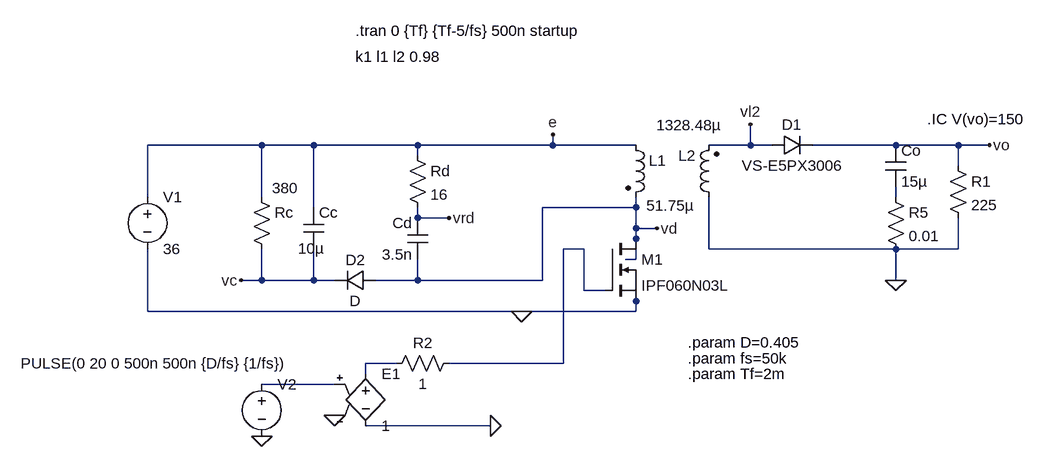
[diagram p0: schematic flyback_ma.asc]
flyback_ma.asc, the LTspice schematic file:
Version 4
SHEET 1 1080 680
WIRE -112 64 -288 64
WIRE -32 64 -112 64
WIRE 128 64 -32 64
WIRE 336 64 336 48
WIRE 336 64 128 64
WIRE 464 64 336 64
WIRE 640 64 640 32
WIRE 640 64 576 64
WIRE 672 64 640 64
WIRE 864 64 736 64
WIRE 960 64 864 64
WIRE 1008 64 960 64
WIRE 128 80 128 64
WIRE 960 96 960 64
WIRE -288 144 -288 64
WIRE -112 144 -112 64
WIRE 864 144 864 128
WIRE -32 160 -32 64
WIRE 464 160 464 144
WIRE 464 160 320 160
WIRE 128 176 128 160
WIRE 176 176 128 176
WIRE 464 192 464 160
WIRE 496 192 464 192
WIRE 464 208 464 192
WIRE 384 224 352 224
WIRE 576 224 576 144
WIRE 864 224 576 224
WIRE 960 224 960 176
WIRE 960 224 864 224
WIRE 464 240 464 208
WIRE 464 240 448 240
WIRE -112 272 -112 224
WIRE -112 272 -144 272
WIRE -32 272 -32 224
WIRE -32 272 -112 272
WIRE 0 272 -32 272
WIRE 128 272 128 240
WIRE 128 272 64 272
WIRE 320 272 320 160
WIRE 320 272 128 272
WIRE 864 272 864 224
WIRE 384 288 384 224
WIRE 416 288 384 288
WIRE 464 304 464 288
WIRE -288 320 -288 224
WIRE 288 320 -288 320
WIRE 464 320 464 304
WIRE 464 320 288 320
WIRE 96 400 48 400
WIRE 352 400 352 224
WIRE 352 400 176 400
WIRE 48 416 48 400
WIRE 0 432 -112 432
WIRE 240 496 48 496
FLAG 864 272 0
FLAG 288 320 0
FLAG 0 480 0
FLAG -112 512 0
FLAG 240 496 0
FLAG 1008 64 vo
FLAG 496 192 vd
FLAG 336 48 e
FLAG -144 272 vc
FLAG 176 176 vrd
FLAG 640 32 vl2
SYMBOL voltage -288 128 R0
WINDOW 123 0 0 Left 2
WINDOW 39 0 0 Left 2
SYMATTR InstName V1
SYMATTR Value 36
SYMBOL ind2 448 48 R0
WINDOW 3 32 109 Left 2
SYMATTR Value 51.75µ
SYMATTR InstName L1
SYMATTR Type ind
SYMBOL ind2 592 160 R180
WINDOW 0 36 80 Left 2
WINDOW 3 -5 127 Left 2
SYMATTR InstName L2
SYMATTR Value 1328.48µ
SYMATTR Type ind
SYMBOL diode 672 80 R270
WINDOW 0 32 32 VTop 2
WINDOW 3 0 32 VBottom 2
SYMATTR InstName D1
SYMATTR Value VS-E5PX3006
SYMBOL cap 848 64 R0
SYMATTR InstName Co
SYMATTR Value 15µ
SYMBOL res 944 80 R0
SYMATTR InstName R1
SYMATTR Value 225
SYMBOL res 192 384 R90
WINDOW 0 0 56 VBottom 2
WINDOW 3 32 56 VTop 2
SYMATTR InstName R2
SYMATTR Value 1
SYMBOL e 48 400 R0
SYMATTR InstName E1
SYMATTR Value 1
SYMBOL voltage -112 416 R0
WINDOW 123 0 0 Left 2
WINDOW 39 0 0 Left 2
WINDOW 3 -371 -16 Left 2
SYMATTR Value PULSE(0 20 0 500n 500n {D/fs} {1/fs})
SYMATTR InstName V2
SYMBOL diode 64 256 R90
WINDOW 0 0 32 VBottom 2
WINDOW 3 32 32 VTop 2
SYMATTR InstName D2
SYMBOL res -128 128 R0
WINDOW 3 32 2 Left 2
SYMATTR Value 380
SYMATTR InstName Rc
SYMBOL cap -48 160 R0
WINDOW 3 -8 63 Left 2
SYMATTR Value 10µ
SYMATTR InstName Cc
SYMBOL res 112 64 R0
SYMATTR InstName Rd
SYMATTR Value 16
SYMBOL cap 144 240 R180
WINDOW 0 24 56 Left 2
WINDOW 3 24 8 Left 2
SYMATTR InstName Cd
SYMATTR Value 3.5n
SYMBOL nmos 416 208 R0
SYMATTR InstName M1
SYMATTR Value IPF060N03L
SYMBOL res 848 128 R0
SYMATTR InstName R5
SYMATTR Value 0.01
TEXT 32 -72 Left 2 !k1 l1 l2 0.98
TEXT 32 -112 Left 2 !.tran 0 {Tf} {Tf-5/fs} 500n startup
TEXT 544 368 Left 2 !.param D=0.405
TEXT 544 392 Left 2 !.param fs=50k
TEXT 912 24 Left 2 !.IC V(vo)=150
TEXT 544 416 Left 2 !.param Tf=2m

The netlist it stands for:
* flyback_ma.asc
V1 e 0 36
L1 e vd 51.75µ
L2 0 vl2 1328.48µ
D1 vl2 vo VS-E5PX3006
Co vo N001 15µ
R1 vo 0 225
R2 N002 N003 1
E1 N003 0 N004 0 1
V2 N004 0 PULSE(0 20 0 500n 500n {D/fs} {1/fs})
D2 vd vc D
Rc e vc 380
Cc e vc 10µ
Rd e vrd 16
Cd vd vrd 3.5n
M1 vd N002 0 0 IPF060N03L
R5 N001 0 0.01
.model D D
.lib standard.dio
.model NMOS NMOS
.model PMOS PMOS
.lib standard.mos
k1 l1 l2 0.98
.tran 0 {Tf} {Tf-5/fs} 500n startup
.param D=0.405
.param fs=50k
.IC V(vo)=150
.param Tf=2m
.backanno
.end